# EAGLE design RTx_Charger_Alternative (EAGLE 6.5.0)
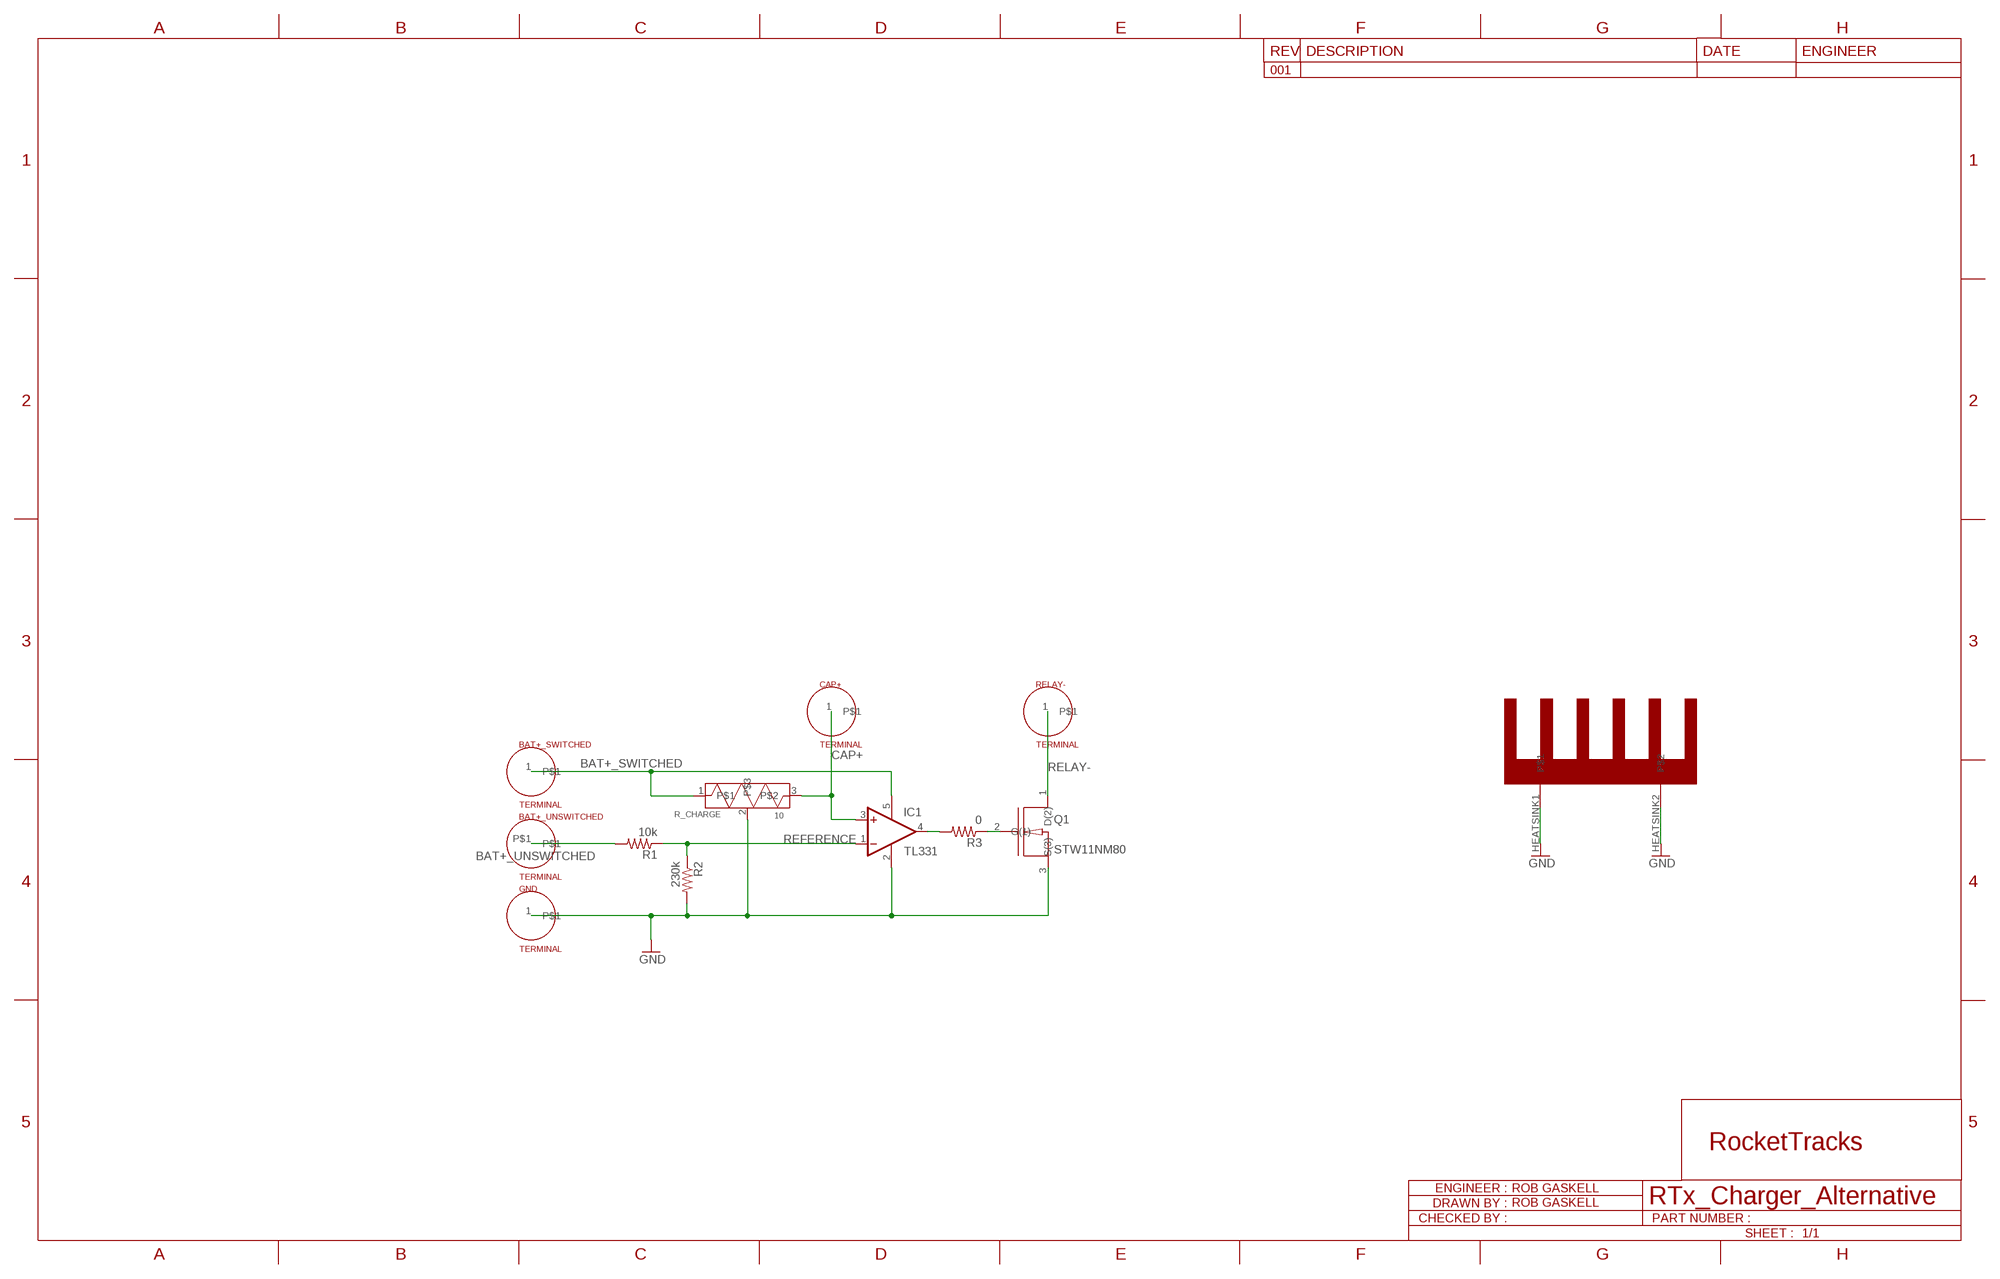
[diagram p0: schematic, sheet 1]

## Parts
BAT+_SWITCHED  TERMINAL  TERMINAL_BATTERY  [TERMINAL_BATTERY]
BAT+_UNSWITCHED  TERMINAL  TERMINAL_RELAY  [TERMINAL_RELAY]
CAP+  TERMINAL  TERMINAL_BATTERY  [TERMINAL_BATTERY]
GND  TERMINAL  TERMINAL_BATTERY  [TERMINAL_BATTERY]
HEATSINK  WA-T247-101E  [WA-T247-101E]
IC1  TL331  [DBV-R-PDSO-G5]
Q1  STW11NM80  [TO-247]
R1  10k  R-US_R1206  [R1206]
R2  230k  R-US_R1206  [R1206]
R3  0  R-US_R1206  [R1206]
R_CHARGE  10  TEH70  [TEH70]
RELAY-  TERMINAL  TERMINAL_BATTERY  [TERMINAL_BATTERY]

## Nets
BAT+_SWITCHED: BAT+_SWITCHED.1 IC1.5(V+) R_CHARGE.1
BAT+_UNSWITCHED: BAT+_UNSWITCHED.P$1 R1.2
CAP+: CAP+.1 IC1.3(+IN) R_CHARGE.3
GND: GND.1 HEATSINK.HEATSINK1 HEATSINK.HEATSINK2 IC1.2(GND) Q1.3(S(3)) R2.2 R_CHARGE.2
N$1: IC1.4(OUT) R3.2
N$5: Q1.2(G(1)) R3.1
REFERENCE: IC1.1(-IN) R1.1 R2.1
RELAY-: Q1.1(D(2)) RELAY-.1

## Library data of the parts
BAT+_SWITCHED CAP+ GND RELAY- = temp_library:TERMINAL_BATTERY
BAT+_UNSWITCHED = temp_library:TERMINAL_RELAY
HEATSINK = temp_library:WA-T247-101E
IC1 = linear:TL331: SINGLE DIFFERENTIAL COMPARATOR Source: Data sheet <http://www.ti.com/lit/ds/symlink/tl331-q1.pdf>
Q1 = temp_library:STW11NM80: N-Channel MOSFET transistor
R1-R3 = motorFeedback:R-US_: RESISTOR, American symbol
R_CHARGE = temp_library:TEH70

## Board
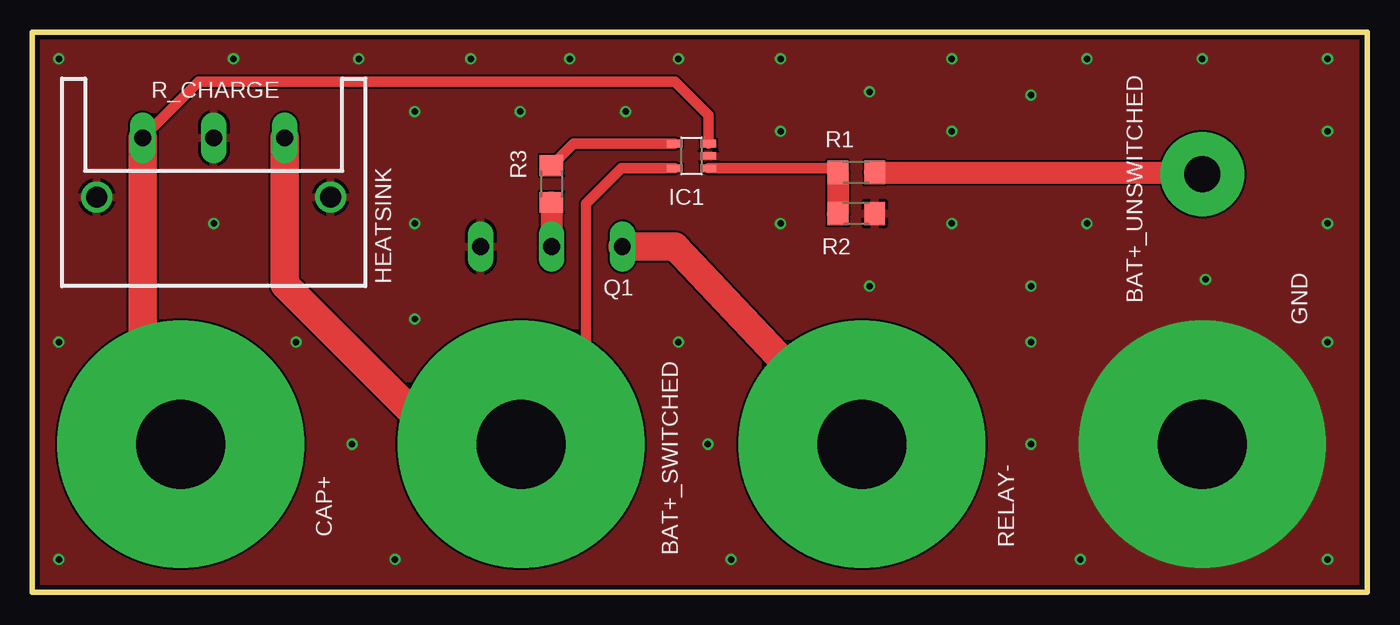
[diagram p1: board, top side]
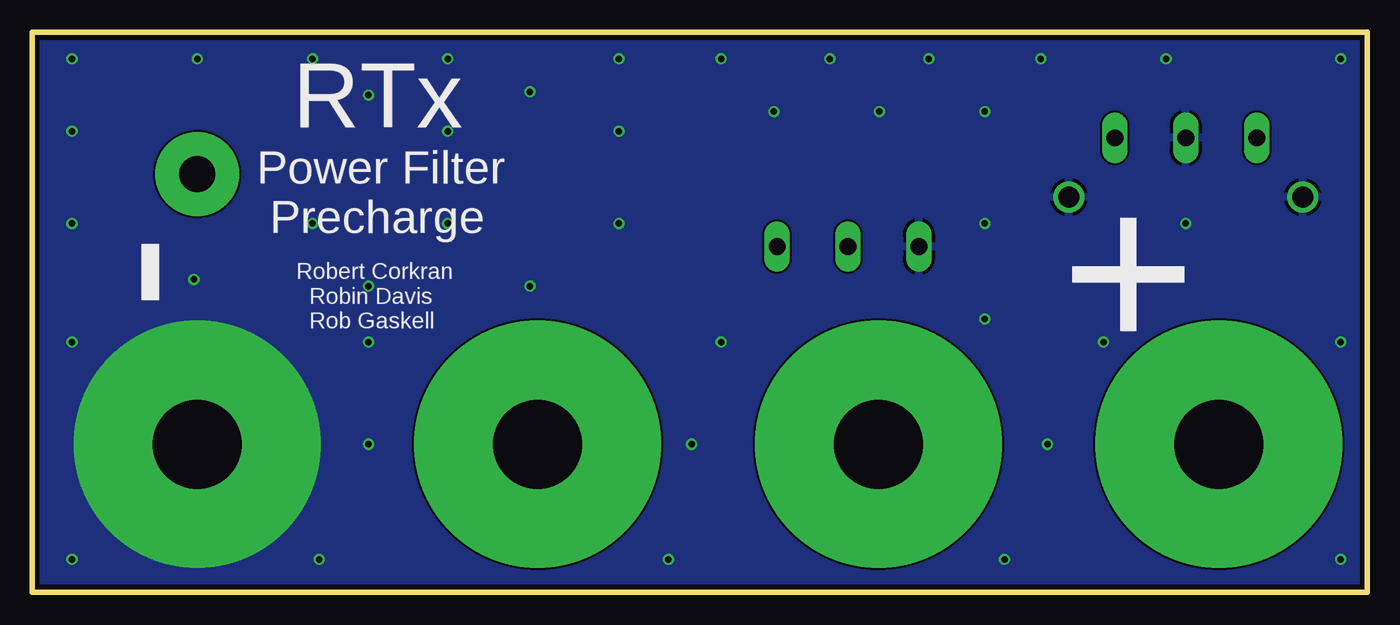
[diagram p2: board, bottom side, seen from below]

Size 102.87 x 43.18 mm. Coordinates in mm from the lower left corner, seen from the top.
Outline: 0,0 102.87,0 102.87,43.18 0,43.18 0,0
Copper layers (1*16): Top 0.0356mm / dielectric 1.5011mm / Bottom 0.0356mm
Design rules "osh-park-2layer *": minimum track width 6mil, minimum drill 13mil, track to track 6mil, track to pad 6mil, pad to pad 6mil, via to via 6mil, smd to smd 6mil, copper to edge 15mil, drill to drill 6mil, minimum pad ring 7mil, minimum via ring 7mil, stop-mask expansion 3mil, vias tented up to drill 30mil, thermal gap 10mil

### Footprints (pad centres in the part's own frame; a part is rotated, then mirrored left to right if it is on the bottom)
TERMINAL_BATTERY = drill 6.858 pad 19.05: 1 0,0
TERMINAL_RELAY = drill 2.8 pad 6.452: P$1 0,0
WA-T247-101E = drill 1.6: HEATSINK1 -9.017,0; HEATSINK2 9.017,0
DBV-R-PDSO-G5 = smd 0.6 x 1.2: 1 -0.95,-1.306; 2 0,-1.306; 3 0.95,-1.306; 4 0.95,1.306; 5 -0.95,1.306
TO-247 = drill 1.3 long: 1 -5.461,0; 2 0,0; 3 5.461,0
R1206 = smd 1.6 x 1.803: 1 -1.422,0; 2 1.422,0
TEH70 = drill 1.3 long: 1 -5.461,-4.572; 2 0,-4.572; 3 5.461,-4.572

### Placement (x,y rotation side)
BAT+_SWITCHED  37.67,11.43 0 top
BAT+_UNSWITCHED  90.17,32.26 0 top
CAP+  11.43,11.43 0 top
GND  90.17,11.43 0 top
HEATSINK  13.97,30.48 180 top
IC1  50.8,33.66 90 top
Q1  40.01,26.67 180 top
R1  63.5,32.38 0 top
R2  63.5,29.21 0 top
R3  40.01,31.5 90 top
R_CHARGE  13.97,30.48 180 top
RELAY-  63.93,11.43 0 top

### Tracks (layer width: path | path; a pad name or v marks a point on that pad's centre or on a via)
BAT+_SWITCHED
  Top 0.813: IC1.5 45.41,32.7 42.67,29.97 42.67,16 BAT+_SWITCHED.1
  Top 2.184: R_CHARGE.1 19.43,23.75 31.75,11.43 BAT+_SWITCHED.1
BAT+_UNSWITCHED
  Top 1.676: R1.2 90.04,32.38 BAT+_UNSWITCHED.P$1
CAP+
  Top 0.813: IC1.3 52.11,36.79 49.53,39.37 12.83,39.37 R_CHARGE.3
  Top 2.184: R_CHARGE.3 8.51,14.35 CAP+.1
GND  (via drill 0.5)
  other vias: 29.46,37.08 29.46,28.45 57.66,35.56 57.66,41.15 64.52,38.61 70.87,41.15 70.87,35.56 37.59,37.08 99.82,41.15 99.82,19.3 76.96,23.62 64.52,23.62 57.66,28.45 49.78,19.3 52.07,11.43 53.85,2.54 80.77,2.54 99.82,2.54 76.96,19.3 2.03,2.54 2.03,19.3 29.46,21.08 20.32,19.3 13.97,28.45 25.15,41.15 2.03,41.15 33.78,41.15 41.4,41.15 49.78,41.15 45.72,37.08 81.28,28.45 76.96,38.35 81.28,41.15 90.17,41.15 15.49,41.15 24.64,11.43 27.94,2.54 76.96,11.43 70.87,28.45 90.42,24.13 99.82,28.45 99.82,35.56
  pour Top: 0,0 102.87,0 102.87,43.18 0,43.18
  pour Bottom: 0,0 102.87,0 102.87,43.18 0,43.18
N$1
  Top 0.813: IC1.4 41.69,34.6 R3.2
N$5
  Top 1.676: R3.1 Q1.2
REFERENCE
  Top 0.406: 61.76,32.7 R1.1
  Top 0.813: IC1.1 61.76,32.7
  Top 1.676: R1.1 R2.1
RELAY-
  Top 2.184: Q1.1 49.53,26.67 RELAY-.1

### Text on the board
bPlace: RTx | + | Power Filter / Precharge | - | Robert Corkran / Robin Davis / Rob Gaskell